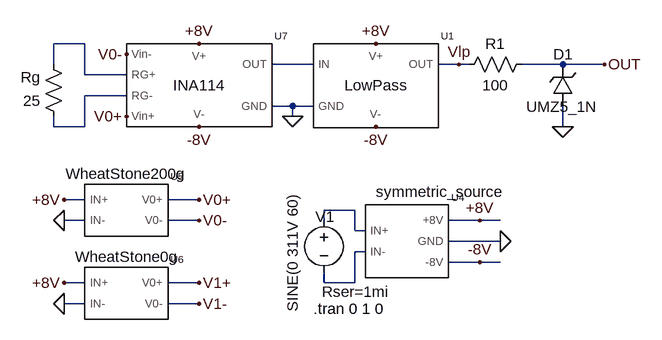
[diagram p0: schematic ERG-Simulation.asc]
ERG-Simulation.asc, the LTspice schematic file:
Version 4.1
SHEET 1 1276 1060
WIRE -1088 272 -1136 272
WIRE -1136 304 -1136 272
WIRE -736 304 -800 304
WIRE -512 304 -544 304
WIRE -496 304 -512 304
WIRE -352 304 -416 304
WIRE -288 304 -352 304
WIRE -1088 320 -1088 272
WIRE -1024 320 -1088 320
WIRE -1024 352 -1088 352
WIRE -768 368 -800 368
WIRE -736 368 -768 368
WIRE -768 384 -768 368
WIRE -1136 400 -1136 384
WIRE -1088 400 -1088 352
WIRE -1088 400 -1136 400
WIRE -352 400 -352 368
WIRE -1088 512 -1120 512
WIRE -912 512 -960 512
WIRE -672 528 -720 528
WIRE -1088 544 -1120 544
WIRE -912 544 -960 544
WIRE -720 544 -720 528
WIRE -480 544 -528 544
WIRE -448 544 -480 544
WIRE -672 560 -672 528
WIRE -656 560 -672 560
WIRE -448 576 -528 576
WIRE -656 592 -672 592
WIRE -480 608 -528 608
WIRE -448 608 -480 608
WIRE -1088 640 -1120 640
WIRE -912 640 -960 640
WIRE -720 640 -720 624
WIRE -672 640 -672 592
WIRE -672 640 -720 640
WIRE -1088 672 -1120 672
WIRE -912 672 -960 672
FLAG -480 544 +8V
FLAG -448 576 0
FLAG -480 608 -8V
FLAG -1120 512 +8V
FLAG -1120 544 0
FLAG -912 544 V0-
FLAG -912 512 V0+
FLAG -1120 640 +8V
FLAG -1120 672 0
FLAG -912 640 V1+
FLAG -912 672 V1-
FLAG -1024 288 V0-
FLAG -1024 384 V0+
FLAG -912 272 +8V
FLAG -912 400 -8V
FLAG -640 272 +8V
FLAG -640 400 -8V
FLAG -768 384 0
FLAG -352 400 0
FLAG -288 304 OUT
FLAG -512 304 Vlp
SYMBOL voltage -720 528 M0
WINDOW 123 0 0 Left 0
WINDOW 39 -101 126 Left 2
WINDOW 0 -16 10 Left 2
WINDOW 3 48 157 VLeft 2
SYMATTR SpiceLine Rser=1mi
SYMATTR InstName V1
SYMATTR Value SINE(0 311V 60)
SYMBOL symmetric-source\\SPICE-models\\Symmetric_Source -592 576 R0
WINDOW 3 50 -76 Center 2
SYMATTR InstName U4
SYMBOL wheatstone-bridge\\SPICE-models\\WheatStone200g -1024 528 R0
SYMATTR InstName U5
SYMBOL wheatstone-bridge\\SPICE-models\\WheatStone0g -1024 656 R0
SYMATTR InstName U6
SYMBOL amp\\SPICE-models\\INA114 -912 336 R0
SYMATTR InstName U7
SYMBOL res -1120 400 R180
WINDOW 0 36 76 Left 2
WINDOW 3 36 40 Left 2
SYMATTR InstName Rg
SYMATTR Value 25
SYMATTR SpiceLine tol=1 pwr=0.250
SYMBOL filter\\SPICE-models\\LowPass -640 336 R0
SYMATTR InstName U1
SYMBOL res -400 288 R90
WINDOW 0 0 56 VBottom 2
WINDOW 3 32 56 VTop 2
SYMATTR InstName R1
SYMATTR Value 100
SYMBOL zener -336 368 R180
WINDOW 0 0 80 Left 2
WINDOW 3 -38 -1 Left 2
SYMATTR InstName D1
SYMATTR Value UMZ5_1N
TEXT -736 680 Left 2 !.tran 0 1 0

The netlist it stands for:
* ERG-Simulation.asc
V1 N004 N005 SINE(0 311V 60) Rser=1mi
X§U4 N004 N005 0 +8V -8V symmetric_source  ; pins IN+ IN- GND +8V -8V
X§U5 +8V 0 V0- V0+ WheatStone200g  ; pins IN+ IN- V0- V0+
X§U6 +8V 0 V1- V1+ WheatStone0g  ; pins IN+ IN- V0- V0+
X§U7 N003 N001 N002 0 V0- +8V -8V V0+ INA114  ; pins RG- RG+ OUT GND Vin- V+ V- Vin+
Rg N003 N001 25 tol=1 pwr=0.250
X§U1 N002 0 +8V -8V Vlp LowPass  ; pins IN GND V+ V- OUT
R1 OUT Vlp 100
D1 0 OUT UMZ5_1N
.model D D
.lib standard.dio
.tran 0 1 0
.lib C:\Users\Acer\repos\ERG-2025\symmetric-source\SPICE-models\Symmetric-Source.CIR
.lib C:\Users\Acer\repos\ERG-2025\wheatstone-bridge\SPICE-models\WheatStone-200g.CIR
.lib C:\Users\Acer\repos\ERG-2025\wheatstone-bridge\SPICE-models\WheatStone-0g.CIR
.lib C:\Users\Acer\repos\ERG-2025\amp\SPICE-models\INA114.CIR
.lib C:\Users\Acer\repos\ERG-2025\filter\SPICE-models\LowPass.CIR
.backanno
.end